# EAGLE design Dog Fountain (EAGLE 6.5.0)
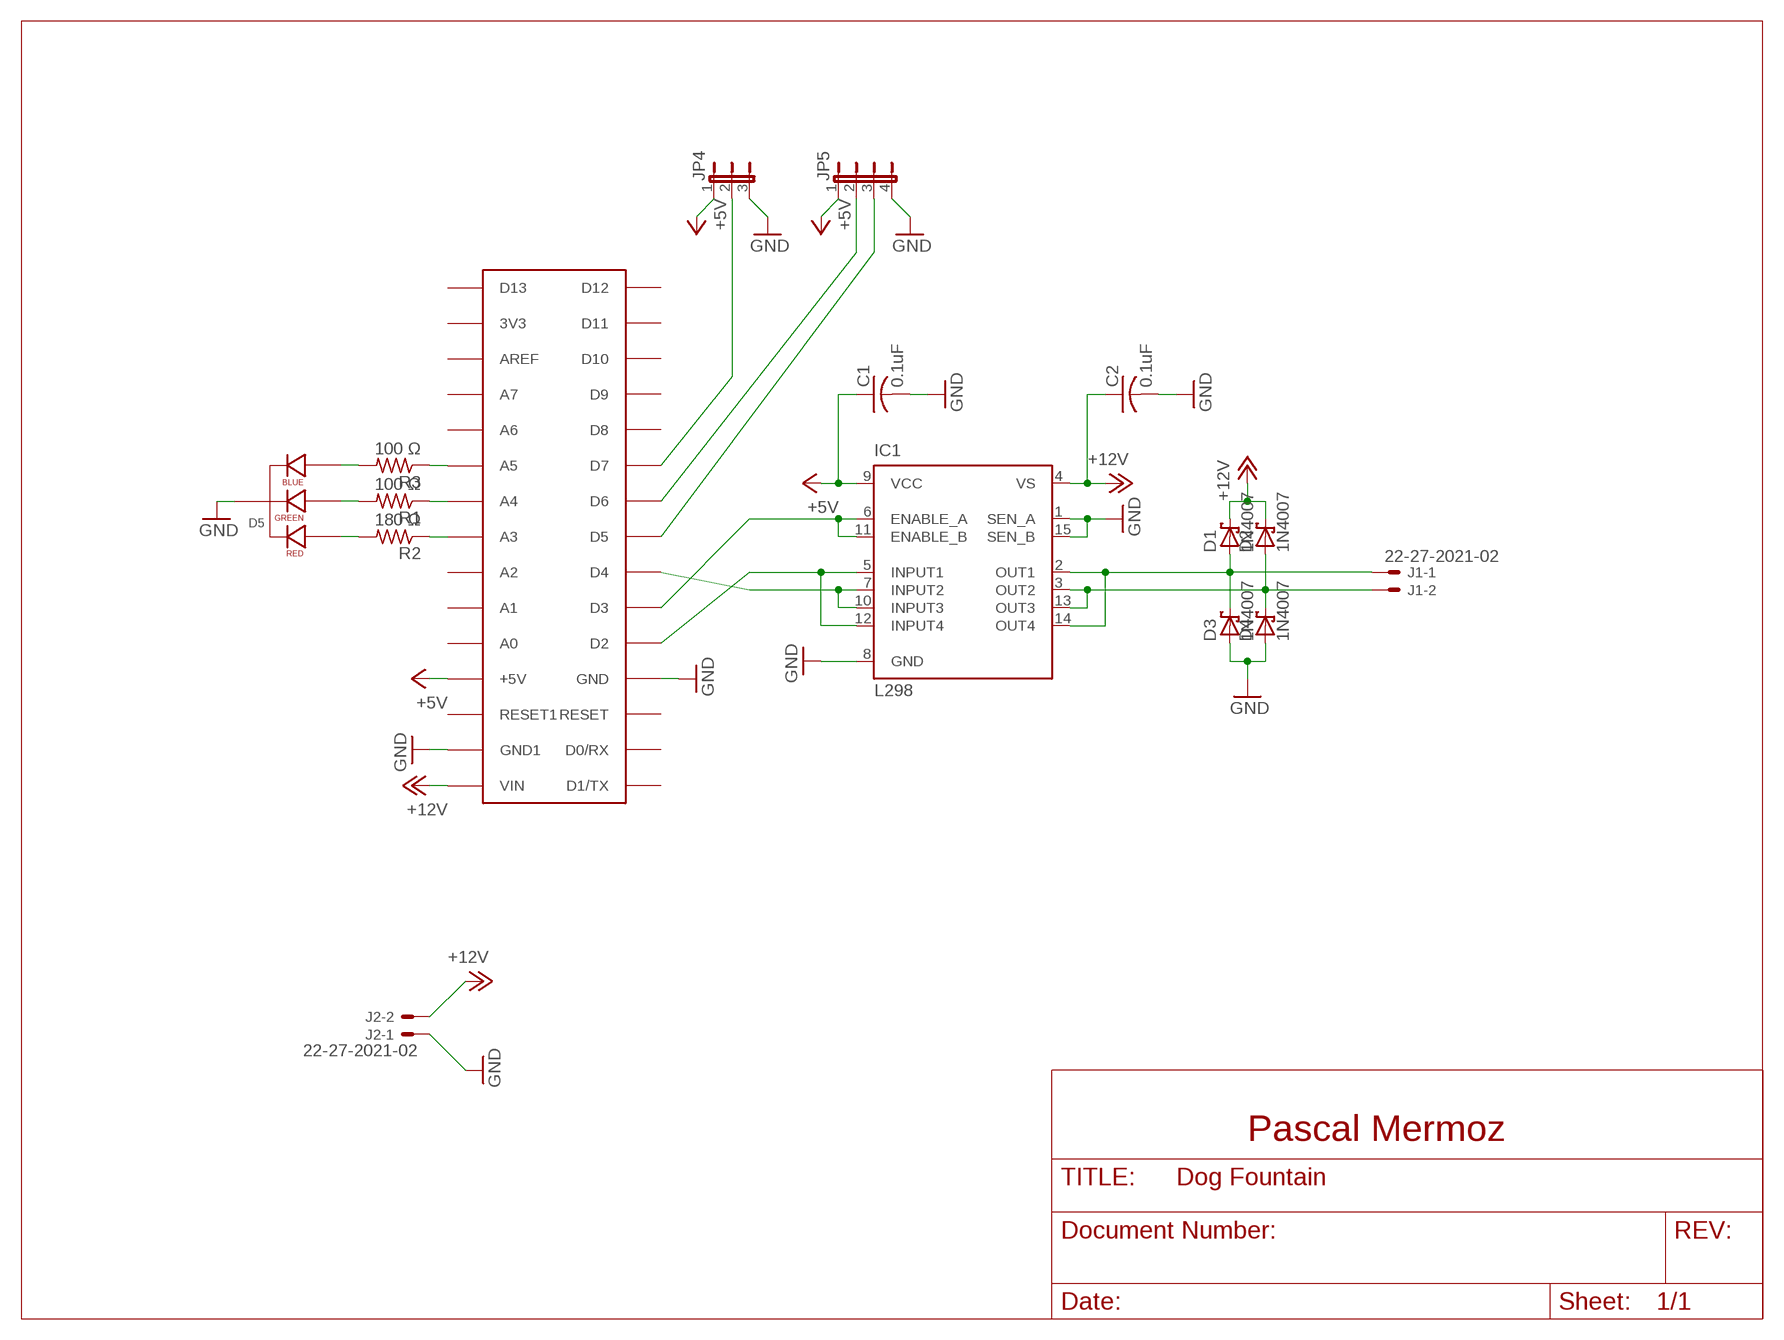
[diagram p0: schematic, sheet 1]

## Parts
C1  0.1uF  C-US050-024X044  [C050-024X044]
C2  0.1uF  C-US050-024X044  [C050-024X044]
D1  1N4007  1N5818-B  [DO41-7.6]
D2  1N4007  1N5818-B  [DO41-7.6]
D3  1N4007  1N5818-B  [DO41-7.6]
D4  1N4007  1N5818-B  [DO41-7.6]
D5  LED-RGB-CC-THRUDIFFUSE  [LED-RGB-THRU]
IC1  L298  [MULTIWATT-15]
J1  22-27-2021-02  [6410-02]
J2  22-27-2021-02  [6410-02]
JP4  JP2E  [JP2]
JP5  JP4E  [JP4]
R1  100 Ω  R-US_0204/2V  [0204V]
R2  180 Ω  R-US_0204/2V  [0204V]
R3  100 Ω  R-US_0204/2V  [0204V]
U$1  ARDUINONANO  [PDIP-32]

## Nets
+5V: C1.1 IC1.9(VCC) JP4.1 JP5.1 U$1.+5V
+12V: C2.1 D1.C D2.C IC1.4(VS) J2.2 U$1.VIN
GND: C1.2 C2.2 D3.A D4.A D5.2(CATHODE) IC1.1(SEN_A) IC1.8(GND) IC1.15(SEN_B) J2.1 JP4.3 JP5.4 U$1.GND U$1.GND1
N$4: IC1.6(ENABLE_A) IC1.11(ENABLE_B) U$1.D3
N$5: IC1.5(INPUT1) IC1.12(INPUT4) U$1.D2
N$6: D2.A D4.C IC1.3(OUT2) IC1.13(OUT3) J1.2
N$7: D1.A D3.C IC1.2(OUT1) IC1.14(OUT4) J1.1
N$8: IC1.7(INPUT2) IC1.10(INPUT3) U$1.D4
N$11: JP4.2 U$1.D7
N$12: JP5.2 U$1.D6
N$13: JP5.3 U$1.D5
N$14: R3.1 U$1.A5
N$15: R1.1 U$1.A4
N$16: R2.1 U$1.A3
N$17: D5.1(RED_CATHODE) R2.2
N$18: D5.3(GREEN_CATHODE) R1.2
N$19: D5.4(BLUE_CATHODE) R3.2
Unconnected: U$1.3V3 U$1.A0 U$1.A1 U$1.A2 U$1.A6 U$1.A7 U$1.AREF U$1.D0/RX U$1.D1/TX U$1.D8 U$1.D9 U$1.D10 U$1.D11 U$1.D12 U$1.D13 U$1.RESET U$1.RESET1

## Notes on the sheet
- Pascal Mermoz

## Library data of the parts
C1 C2 = rcl:C-US: CAPACITOR, American symbol; MPN: C317C104K5R5TA; OC_NEWARK: 60M1325
D1-D4 = diode:1N581*: 1.0A SCHOTTKY BARRIER RECTIFIER Source: http://www.diodes.com/datasheets/ds23001.pdf; MPN: KBP202G; OC_NEWARK: 90R8778
D5 = SparkFun-LED:LED-RGB-CC-THRU: RGB Through-hole common cathode LED SparkFun Storefront: COM-00105 (Clear) COM-09264 (Diffuse); PROD_ID: DIO-09434
IC1 = st-microelectronics:L298: DUAL FULL-BRIDGE DRIVER; MPN: L298N; OC_FARNELL: 1589425; OC_NEWARK: 32M1527
J1 J2 = con-molex:22-?-02: CONNECTOR wire to board 2.54 mm (.1 inch) pitch header; OC_FARNELL: unknown; OC_NEWARK: unknown
JP4 = jumper:JP2E: JUMPER
JP5 = jumper:JP4E: JUMPER
R1-R3 = rcl:R-US_: RESISTOR, American symbol
U$1 = jet-lib:ARDUINONANO; MPN: A000005; OC_NEWARK: 13T9275

## Net classes
0 default: width 0.305 mm, drill 0.508 mm, clearance 0.254 mm

## Board
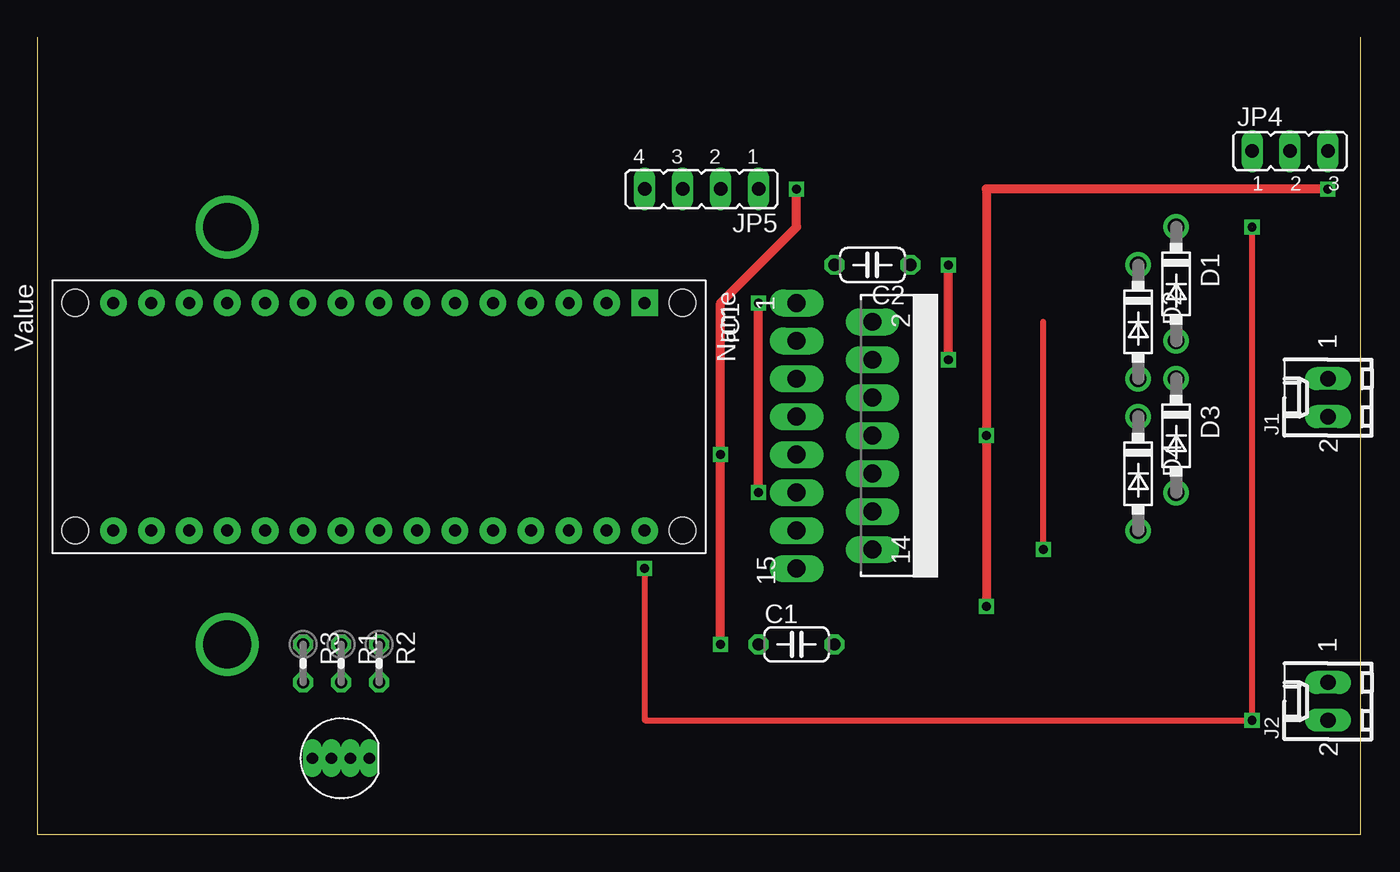
[diagram p1: board, top side]
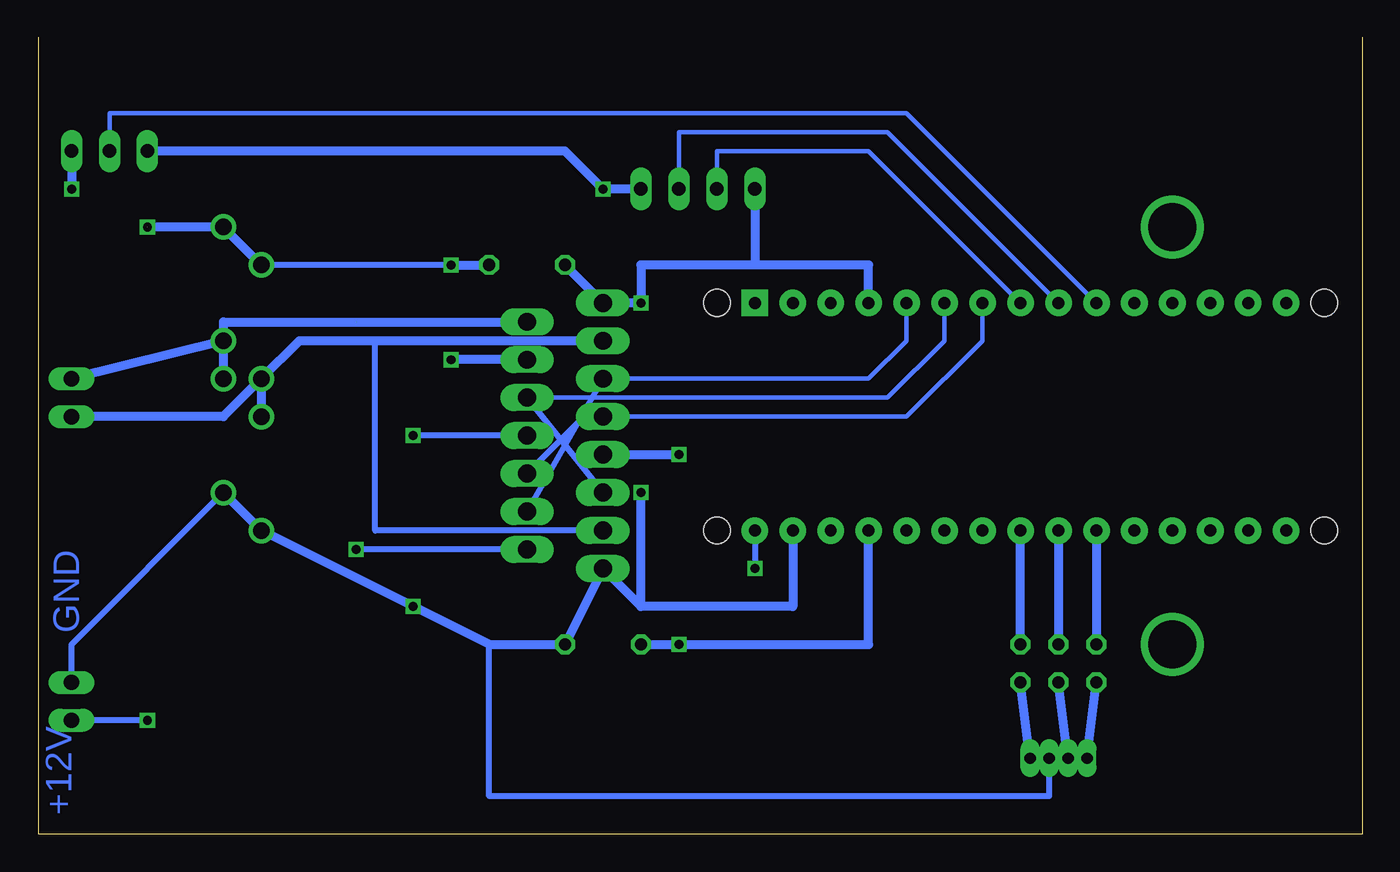
[diagram p2: board, bottom side, seen from below]

Size 88.57 x 53.33 mm. Coordinates in mm from the lower left corner, seen from the top.
Outline: 88.57,53.33 88.57,0 0,0 0,53.33
Copper layers (1*16): Top 0.035mm / dielectric 1.5mm / Bottom 0.035mm
Design rules "default": minimum track width 10mil, minimum drill 24mil, track to track 8mil, track to pad 8mil, pad to pad 8mil, via to via 8mil, smd to smd 8mil, copper to edge 40mil, drill to drill 8mil, minimum pad ring 10mil, minimum via ring 8mil, stop-mask expansion 4mil, vias tented up to drill 0mil, thermal gap 10mil
tRestrict: area 22.9,45.7 to 66,53.3; area 40.6,44.5 to 48.3,45.7; area 68.6,43.2 to 78.7,53.3; area 78.7,48.3 to 88.9,53.3; area 88.9,43.2 to 99.1,53.3
bRestrict: 1 lines
vRestrict: area 0,45.7 to 7.6,53.3; area 0,0 to 7.6,7.6

### Footprints (pad centres in the part's own frame; a part is rotated, then mirrored left to right if it is on the bottom)
C050-024X044 = drill 0.813 octagon: 1 -2.54,0; 2 2.54,0
DO41-7.6 = drill 1.1 pad 1.7: A 3.81,0; C -3.81,0
LED-RGB-THRU = drill 0.762 pad 0.889 long: 1 1.905,0; 2 0.635,0; 3 -0.635,0; 4 -1.905,0
MULTIWATT-15 = drill 1.2 long: 1 -8.89,-7.62; 2 -7.62,-2.54; 3 -6.35,-7.62; 4 -5.08,-2.54; 5 -3.81,-7.62; 6 -2.54,-2.54; 7 -1.27,-7.62; 8 0,-2.54; 9 1.27,-7.62; 10 2.54,-2.54; 11 3.81,-7.62; 12 5.08,-2.54; 13 6.35,-7.62; 14 7.62,-2.54; 15 8.89,-7.62
6410-02 = drill 1.016 long: 1 1.27,0; 2 -1.27,0
JP2 = drill 0.914 long: 1 -2.54,0; 2 0,0; 3 2.54,0
JP4 = drill 0.914 long: 1 -3.81,0; 2 -1.27,0; 3 1.27,0; 4 3.81,0
0204V = drill 0.813 octagon: 1 -1.27,0; 2 1.27,0
PDIP-32 = drill 0.8 pad 1.778: 3V3 15.24,-35.56; +5V 15.24,-10.16; A0 15.24,-12.7; A1 15.24,-15.24; A2 15.24,-17.78; A3 15.24,-20.32; A4 15.24,-22.86; A5 15.24,-25.4; A6 15.24,-27.94; A7 15.24,-30.48; AREF 15.24,-33.02; D0/RX 0,-5.08; D2 0,-12.7; D3 0,-15.24; D4 0,-17.78; D5 0,-20.32; D6 0,-22.86; D7 0,-25.4; D8 0,-27.94; D9 0,-30.48; D10 0,-33.02; D11 0,-35.56; D12 0,-38.1; D13 15.24,-38.1; GND 0,-10.16; GND1 15.24,-5.08; RESET 0,-7.62; RESET1 15.24,-7.62; VIN 15.24,-2.54 | drill 0.8 pad 1.778 square: D1/TX 0,-2.54 | hole 1.778: 0,0; 0,-40.64; 15.24,-40.64; 15.24,0

### Placement (x,y rotation side)
C1  50.8,12.7 0 top
C2  55.88,38.1 180 top
D1  76.2,36.83 270 top
D2  73.66,34.29 270 top
D3  76.2,26.67 270 top
D4  73.66,24.13 270 top
D5  20.32,5.08 0 top
IC1  58.42,26.67 270 top
J1  86.36,29.21 90 top
J2  86.36,8.89 90 top
JP4  83.82,45.72 0 top
JP5  44.45,43.18 180 top
R1  20.32,11.43 270 top
R2  22.86,11.43 270 top
R3  17.78,11.43 270 top
U$1  43.18,35.56 270 top

### Tracks (layer width: path | path; a pad name or v marks a point on that pad's centre or on a via)
+5V  (via drill 0.6)
  Top 0.61: v45.72,12.7 v45.72,25.4 45.72,35.56 50.8,40.64 v50.8,43.18
  Bottom 0.61: C1.1 v45.72,12.7 33.02,12.7 U$1.+5V | JP4.1 53.34,45.72 v50.8,43.18 JP5.1 | IC1.9 v45.72,25.4
+12V  (via drill 0.6)  (1 unrouted)
  Top 0.406: v40.64,17.78 40.64,7.62 v81.28,7.62 81.28,40.64
  Top 0.61: v60.96,31.75 v60.96,38.1
  Bottom 0.406: U$1.VIN v40.64,17.78 | v81.28,7.62 J2.2 | v60.96,38.1 D2.C
  Bottom 0.61: D2.C D1.C 81.28,40.64 | IC1.4 v60.96,31.75 | v60.96,38.1 C2.1
GND  (via drill 0.6)
  Top 0.61: v48.26,22.86 v48.26,35.56 | v86.36,43.18 63.5,43.18 v63.5,26.67 v63.5,15.24
  Bottom 0.406: J2.1 86.36,12.7 D3.A | D5.2 20.95,2.54 58.42,2.54 58.42,12.7 | IC1.8 v63.5,26.67
  Bottom 0.61: D3.A D4.A v63.5,15.24 58.42,12.7 C1.2 IC1.15 48.26,15.24 | C2.2 IC1.1 v48.26,35.56 48.26,38.1 40.64,38.1 | 48.26,15.24 v48.26,22.86 | U$1.GND1 38.1,15.24 48.26,15.24 | JP4.3 v86.36,43.18 | U$1.GND 33.02,38.1 40.64,38.1 | JP5.4 40.64,38.1
N$1  (via drill 3.2)
  other vias: 12.7,40.64
N$2  (via drill 3.2)
  other vias: 12.7,12.7
N$4
  Bottom 0.305: U$1.D3 27.94,33.02 31.75,29.21 IC1.6
  Bottom 0.406: IC1.11 IC1.6
N$5
  Bottom 0.305: U$1.D2 30.48,33.02 33.02,30.48 IC1.5
  Bottom 0.406: IC1.5 IC1.12
N$6
  Bottom 0.406: IC1.13 66.04,20.32 66.04,33.02
  Bottom 0.61: D2.A 76.2,27.94 J1.2 | IC1.3 66.04,33.02 71.12,33.02 D2.A | D2.A D4.C
N$7  (via drill 0.6)  (1 unrouted)
  Top 0.406: v67.31,19.05 67.31,34.29
  Bottom 0.406: IC1.14 v67.31,19.05
  Bottom 0.61: D1.A J1.1 | D1.A 76.2,34.29 IC1.2 | D1.A D3.C
N$8
  Bottom 0.305: U$1.D4 25.4,33.02 30.48,27.94 IC1.7
  Bottom 0.406: IC1.7 52.07,27.94 IC1.10
N$11
  Bottom 0.305: JP4.2 83.82,48.26 30.48,48.26 U$1.D7
N$12
  Bottom 0.305: JP5.2 45.72,46.99 31.75,46.99 U$1.D6
N$13
  Bottom 0.305: JP5.3 43.18,45.72 33.02,45.72 U$1.D5
N$14
  Bottom 0.61: U$1.A5 R3.1
N$15
  Bottom 0.61: U$1.A4 R1.1
N$16
  Bottom 0.61: R2.1 U$1.A3
N$17
  Bottom 0.61: D5.1 R2.2
N$18
  Bottom 0.61: D5.3 R1.2
N$19
  Bottom 0.61: D5.4 R3.2
N$29  (via drill 0.6)
  other vias: 81.28,40.64

### Text on the board
Bottom: GND | +12V